# Altium schematic sheet mcu.SchDoc
size A4
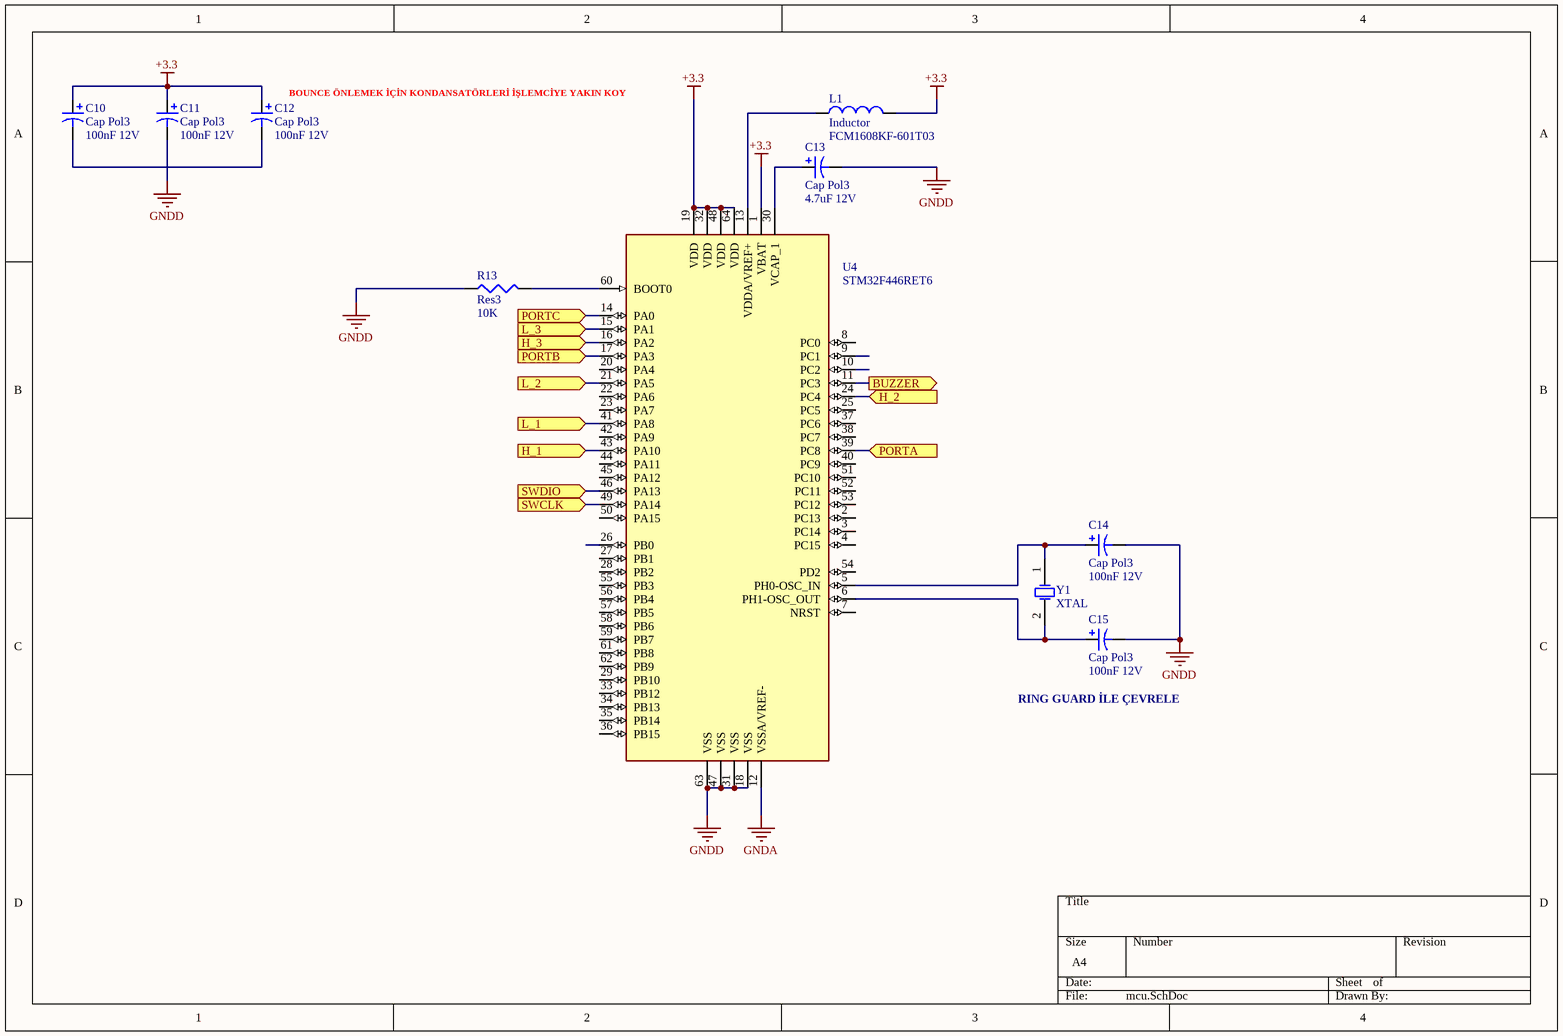
[diagram p0: mcu.SchDoc]

## Parts
C10  Cap Pol3  value 100nF 12V  [C0805]
C11  Cap Pol3  value 100nF 12V  [C0805]
C12  Cap Pol3  value 100nF 12V  [C0805]
C13  Cap Pol3  value 4.7uF 12V  [C0805]
C14  Cap Pol3  value 100nF 12V  [C0805]
C15  Cap Pol3  value 100nF 12V  [C0805]
L1  Inductor  value FCM1608KF-601T03  [0402-A]
R13  Res3  value 10K  [J1-0603]
U4  STM32F446RET6  [STM32F4]
Y1  XTAL  [R38]

## Ports
BUZZER (out), H_1 (in), H_2 (in), H_3 (in), L_1 (in), L_2 (in), L_3 (in), PORTA (in), PORTB (in), PORTC (in), SWCLK (in), SWDIO (in)

## Nets
+3.3: C10.1 C11.1 C12.1 L1.2 U4.1(VBAT) U4.19(VDD) U4.32(VDD) U4.48(VDD) U4.64(VDD)
GNDA: U4.12(VSSA/VREF-)
GNDD: C11.2 C13.2 C14.2 C15.2 R13.1 U4.18(VSS) U4.31(VSS) U4.47(VSS) U4.63(VSS)
BUZZER: U4.11(PC3) ; port BUZZER
H_1: U4.43(PA10) ; port H_1
H_2: U4.24(PC4) ; port H_2
H_3: U4.16(PA2) ; port H_3
L_1: U4.41(PA8) ; port L_1
L_2: U4.21(PA5) ; port L_2
L_3: U4.15(PA1) ; port L_3
PORTA: U4.39(PC8) ; port PORTA
PORTB: U4.17(PA3) ; port PORTB
PORTC: U4.14(PA0) ; port PORTC
SWCLK: U4.49(PA14) ; port SWCLK
SWDIO: U4.46(PA13) ; port SWDIO
NetC10_2: C10.2 C12.2
NetC13_1: C13.1 U4.30(VCAP_1)
NetC14_1: C14.1 U4.5(PH0-OSC_IN) Y1.1(OSC1)
NetC15_1: C15.1 U4.6(PH1-OSC_OUT) Y1.2(OSC2)
NetL1_1: L1.1 U4.13(VDDA/VREF+)
NetR13_2: R13.2 U4.60(BOOT0)

Not connected (* = marked no-connect by the designer): U4 2(PC13) 3(PC14) 4(PC15) 7(NRST) 8(PC0) 9(PC1) 10(PC2) 20(PA4) 22(PA6) 23(PA7) 25(PC5) 26(PB0) 27(PB1) 28(PB2) 29(PB10) 33(PB12) 34(PB13) 35(PB14) 36(PB15) 37(PC6) 38(PC7) 40(PC9) 42(PA9) 44(PA11) 45(PA12) 50(PA15) 51(PC10) 52(PC11) 53(PC12) 54(PD2) 55(PB3) 56(PB4) 57(PB5) 58(PB6) 59(PB7) 61(PB8) 62(PB9)

## Notes on the sheet
- (near C12) BOUNCE ÖNLEMEK İÇİN KONDANSATÖRLERİ İŞLEMCİYE YAKIN KOY
- RING GUARD İLE ÇEVRELE

## Library data of the parts
C10-C15 = Cap Pol3: Polarized Capacitor (Surface Mount); Published: 8-Jun-2000; LatestRevisionDate: 29-May-2009; LatestRevisionNote: IPC-7351 Footprint Added.; PackageReference: C0805; Publisher: Altium Limited; PackageDescription: Chip Capacitor
L1 = Inductor: Code_IEC: 1005; Published: 8-Jun-2000; LatestRevisionDate: 29-May-2009; LatestRevisionNote: IPC-7351 Footprint Added.; PackageReference: 0402-A; Publisher: Altium Limited; PackageDescription: Chip Inductor; Code_JEITA: 0402
R13 = Res3: Resistor; Published: 8-Jun-2000; LatestRevisionDate: 29-May-2009; LatestRevisionNote: IPC-7351 Footprint Added.; PackageReference: J1-0603; Publisher: Altium Limited; PackageDescription: Chip Resistor
U4 = STM32F446RET6: MCU 32-Bit STM32 ARM Cortex M4 RISC 512KB Flash 2.5V/3.3V 64-Pin LQFP Tray; Availability: Unavailable; Package: None; MP: STM32F446RET6; Value: *; Price: None
Y1 = XTAL: Crystal Oscillator; Published: 8-Jun-2000; LatestRevisionDate: 17-Jul-2002; LatestRevisionNote: Re-released for DXP Platform.; PackageReference: R38; Publisher: Altium Limited; PackageDescription: Crystal, Thru-Hole; 2 Leads; Body 3.1 x 8.2 mm (Dia.xH)